# EAGLE design DotLogger (EAGLE 7.2.0)
CNAME: µArduino; CREVISION: 1.0; DATE: 28.04.2015; DESIGNER: Prajwal Bhattaram
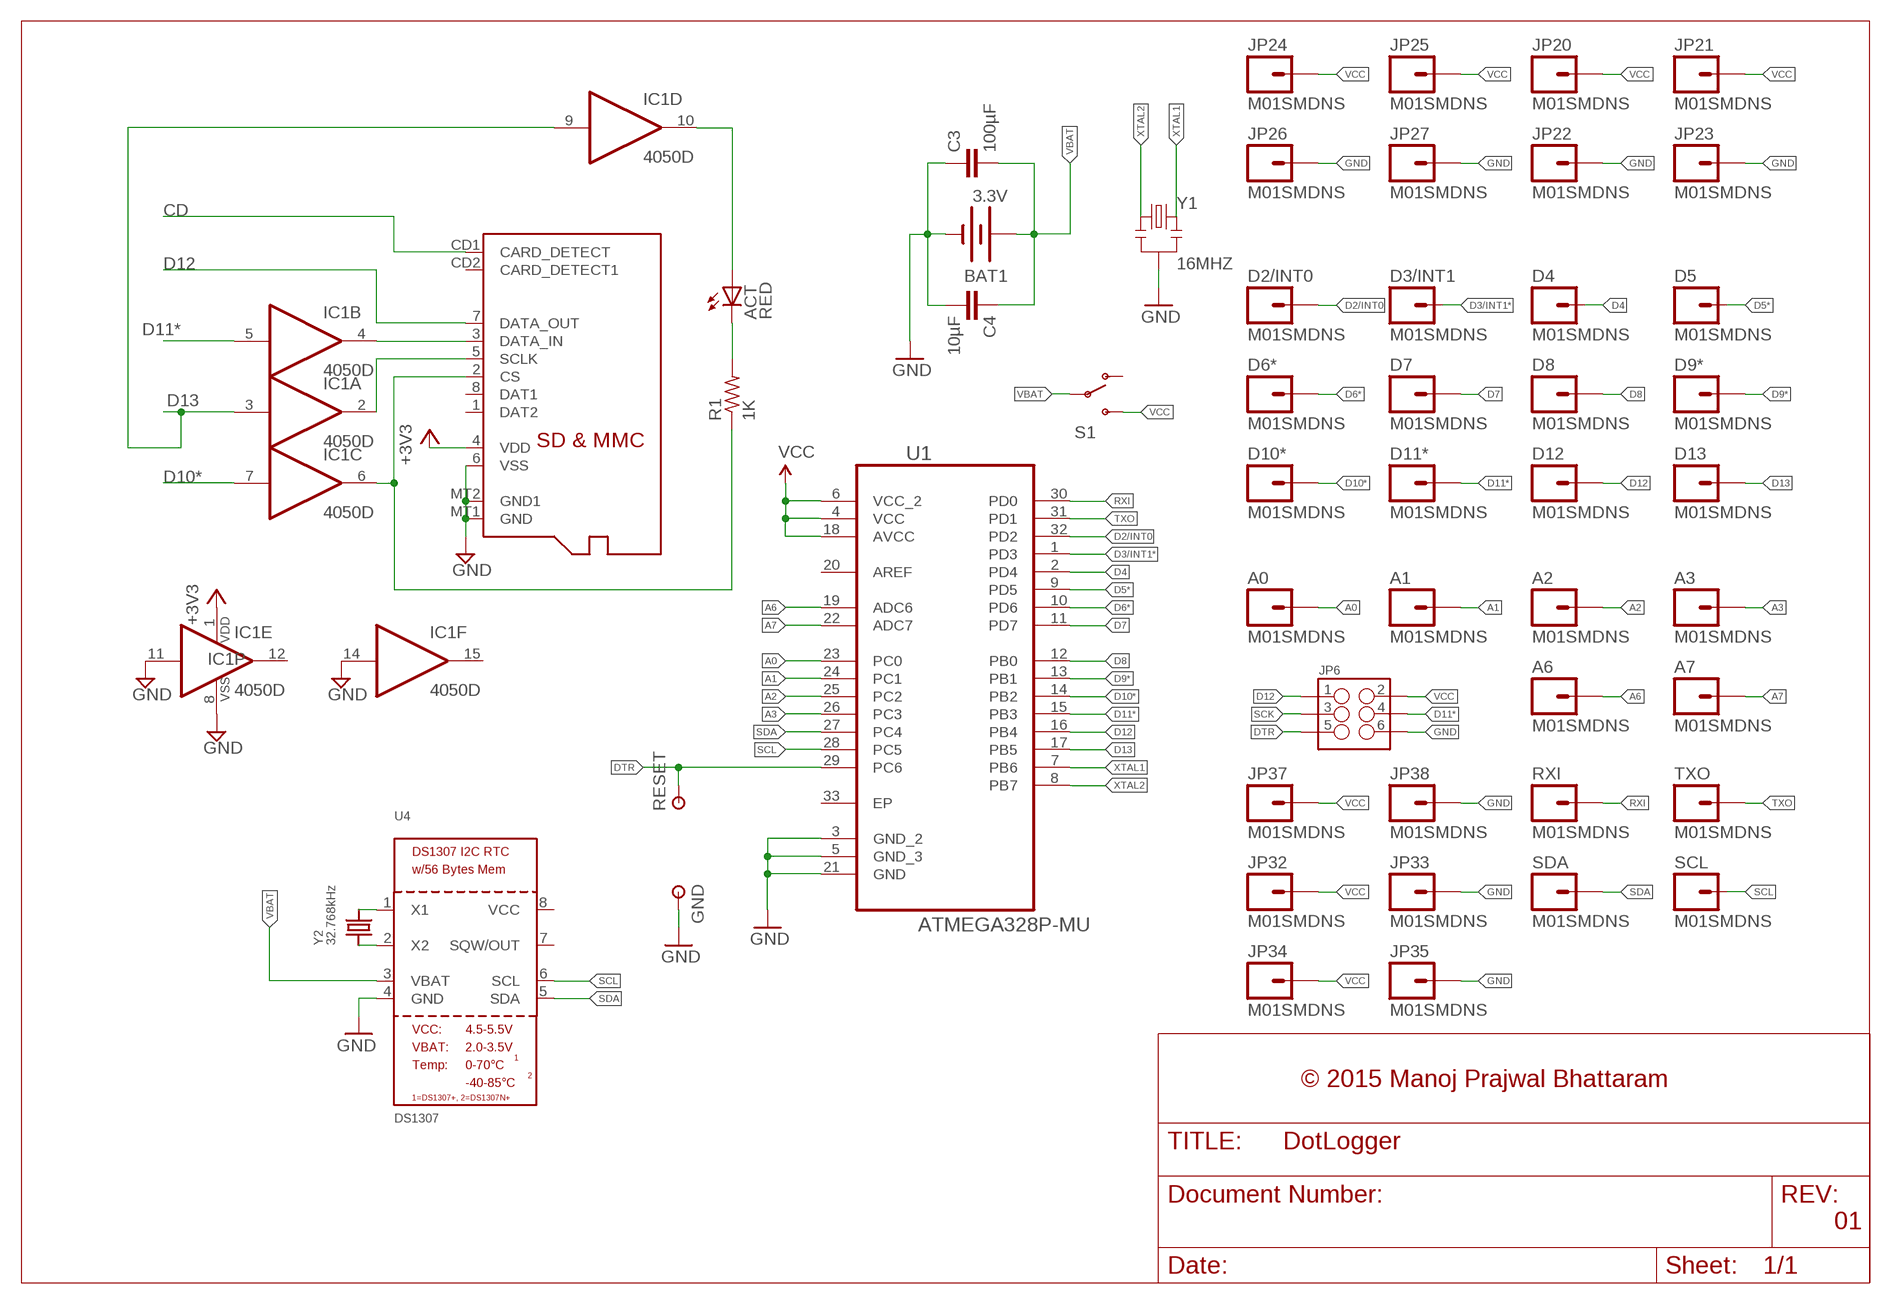
[diagram p0: schematic, sheet 1]

## Parts
A0  M01SMDNS  [1X01NS]
A1  M01SMDNS  [1X01NS]
A2  M01SMDNS  [1X01NS]
A3  M01SMDNS  [1X01NS]
A6  M01SMDNS  [1X01NS]
A7  M01SMDNS  [1X01NS]
ACT  RED  LEDCHIP-LED0805  [CHIP-LED0805]
BAT1  3.3V  BATTERY20SMD  [BATTCON_20MM]
C3  100µF  CAP0402-CAP  [0402-CAP]
C4  10µF  CAP0402-CAP  [0402-CAP]
D2/INT0  M01SMDNS  [1X01NS]
D3/INT1  M01SMDNS  [1X01NS]
D4  M01SMDNS  [1X01NS]
D5  M01SMDNS  [1X01NS]
D6*  M01SMDNS  [1X01NS]
D7  M01SMDNS  [1X01NS]
D8  M01SMDNS  [1X01NS]
D9*  M01SMDNS  [1X01NS]
D10*  M01SMDNS  [1X01NS]
D11*  M01SMDNS  [1X01NS]
D12  M01SMDNS  [1X01NS]
D13  M01SMDNS  [1X01NS]
GND  PAD-TESTPOINT  [1,6/0,8]
IC1  4050D  [SO16]
JP6  M03X2POGO_PINS  [2X3_POGO]
JP20  M01SMDNS  [1X01NS]
JP21  M01SMDNS  [1X01NS]
JP22  M01SMDNS  [1X01NS]
JP23  M01SMDNS  [1X01NS]
JP24  M01SMDNS  [1X01NS]
JP25  M01SMDNS  [1X01NS]
JP26  M01SMDNS  [1X01NS]
JP27  M01SMDNS  [1X01NS]
JP32  M01SMDNS  [1X01NS]
JP33  M01SMDNS  [1X01NS]
JP34  M01SMDNS  [1X01NS]
JP35  M01SMDNS  [1X01NS]
JP37  M01SMDNS  [1X01NS]
JP38  M01SMDNS  [1X01NS]
R1  1K  R-US_R0805  [R0805]
RESET  PAD-TESTPOINT  [1,6/0,8]
RXI  M01SMDNS  [1X01NS]
S1  SWITCH-SPDT-SMD-A  [SWITCH-SPST-SMD-A]
SCL  M01SMDNS  [1X01NS]
SDA  M01SMDNS  [1X01NS]
TXO  M01SMDNS  [1X01NS]
U1  ATMEGA328P-MU  [QFN50P500X500X100-33N]
U4  DS1307  RTC_DS1307  [SOIC8_150MIL]
X1  MICROSD  [MICROSD]
Y1  16MHZ  RESONATOR16MHZ  [RESONATOR-SMD]
Y2  32.768kHz  CRYSTAL8X3.8SMT  [CRYSTAL_8X3.8]

## Nets
+3V3: IC1.1(P:VDD) X1.4(VDD)
A0: A0.1 U1.23(PC0)
A1: A1.1 U1.24(PC1)
A2: A2.1 U1.25(PC2)
A3: A3.1 U1.26(PC3)
A6: A6.1 U1.19(ADC6)
A7: A7.1 U1.22(ADC7)
CD: X1.CD1(CARD_DETECT)
D2/INT0: D2/INT0.1 U1.32(PD2)
D3/INT1*: D3/INT1.1 U1.1(PD3)
D4: D4.1 U1.2(PD4)
D5*: D5.1 U1.9(PD5)
D6*: D6*.1 U1.10(PD6)
D7: D7.1 U1.11(PD7)
D8: D8.1 U1.12(PB0)
D9*: D9*.1 U1.13(PB1)
D10*: D10*.1 IC1.7(C:I) U1.14(PB2)
D11*: D11*.1 IC1.5(B:I) JP6.P$4 U1.15(PB3)
D12: D12.1 JP6.P$1 U1.16(PB4) X1.7(DATA_OUT)
D13: D13.1 IC1.3(A:I) IC1.9(D:I) U1.17(PB5)
DTR: JP6.P$5 RESET.1(P) U1.29(PC6)
GND: BAT1.2(-) C3.1 C4.2 GND.1(P) IC1.8(P:VSS) IC1.11(E:I) IC1.14(F:I) JP6.P$6 JP22.1 JP23.1 JP26.1 JP27.1 JP33.1 JP35.1 JP38.1 U1.3(GND_2) U1.5(GND_3) U1.21(GND) U4.4(GND) X1.6(VSS) X1.MT1(GND) X1.MT2(GND1) Y1.2
N$1: ACT.A IC1.10(D:O)
N$2: IC1.2(A:O) X1.5(SCLK)
N$3: IC1.6(C:O) R1.1 X1.2(CS)
N$4: ACT.C R1.2
N$5: IC1.4(B:O) X1.3(DATA_IN)
N$6: U4.2(X2) Y2.P$1
N$7: U4.1(X1) Y2.P$4
RXI: RXI.1 U1.30(PD0)
SCK: JP6.P$3
SCL: SCL.1 U1.28(PC5) U4.6(SCL)
SDA: SDA.1 U1.27(PC4) U4.5(SDA)
TXO: TXO.1 U1.31(PD1)
VBAT: BAT1.1(+) C3.2 C4.1 S1.2(P) U4.3(VBAT)
VCC: JP6.P$2 JP20.1 JP21.1 JP24.1 JP25.1 JP32.1 JP34.1 JP37.1 S1.3(S) U1.4(VCC) U1.6(VCC_2) U1.18(AVCC)
XTAL1: U1.7(PB6) Y1.3
XTAL2: U1.8(PB7) Y1.1
Unconnected: IC1.12(E:O) IC1.15(F:O) S1.1(O) U1.20(AREF) U1.33(EP) U4.7(SQW/OUT) U4.8(VCC) X1.1(DAT2) X1.8(DAT1) X1.CD2(CARD_DETECT1)

## Notes on the sheet
- © 2015 Manoj Prajwal Bhattaram
- 01

## Library data of the parts
A0 A1-A3 A6 A7 D2/INT0 D3/INT1 D4 D5 D6* D7 D8 D9* D10* D11* D12 D13 JP20-JP27 JP32-JP35 JP37 JP38 RXI SCL SDA TXO = SparkFun-Connectors:M01: Header 1 Standard 1-pin 0.1" header. Use with straight break away headers (SKU : PRT-00116), right angle break away headers (PRT-00553), swiss pins (PRT-00743), machine pins (PRT-00117), and female headers (PRT-00115).
ACT = adafruit:LED: LED OSRAM: - CHIPLED LG R971, LG N971, LY N971, LG Q971, LY Q971, LO R971, LY R971 LH N974, LH R974 LS Q976, LO Q976, LY Q976 LO Q996 - Hyper CHIPLED LW Q18S LB Q993, LB Q99A, LB R99A - SideLED LS A670, LO A670, LY A670, LG A670, LP A670 LB A673, LV A673, LT A673, LW A673 LH A674 LY A675 LS A676, LA A676, LO A676, LY A676, LW A676 LS A679, LY A679, LG A679 - Hyper Micro SIDELED® LS Y876, LA Y876, LO Y876, LY Y876 LT Y87S - SmartLED LW L88C, LW L88S LB L89C, LB L89S, LG L890 LS L89K, LO L89K, LY L89K LS L896, LA L896, LO L896, LY L896 - TOPLED LS T670, LO T670, LY T670, LG T670, LP T670 LSG T670, LSP T670, LSY T670, LOP T670, LYG T670 LG T671, LOG T671, LSG T671 LB T673, LV T673, LT T673, LW T673 LH T674 LS T676, LA T676, LO T676, LY T676, LB T676, LH T676, LSB T676, LW T676 LB T67C, LV T67C, LT T67C, LS T67K, LO T67K, LY T67K, LW E67C LS E67B, LA E67B, LO E67B, LY E67B, LB E67C, LV E67C, LT E67C LW T67C LS T679, LY T679, LG T679 LS T770, LO T770, LY T770, LG T770, LP T770 LB T773, LV T773, LT T773, LW T773 LH T774 LS E675, LA E675, LY E675, LS T675 LS T776, LA T776, LO T776, LY T776, LB T776 LHGB T686 LT T68C, LB T68C - Hyper Mini TOPLED® LB M676 - Mini TOPLED Santana® LG M470 LS M47K, LO M47K, LY M47K Source: http://www.osram.convergy.de/
BAT1 = SparkFun-Electromechanical:BATTERY: Battery Holders Various common sizes : AA, AAA, 20mm coin cell and 12mm coin cell. 20MM_4LEGS, BATT-10373
C3 C4 = SparkFun-Capacitors:CAP: Capacitor Standard 0603 ceramic capacitor, and 0.1" leaded capacitor.
GND RESET = ee2parts:PAD-TESTPOINT: SMALL THROUGH-HOLE PAD/TESTPOINT Pad suitable for use as a test point (no pin)
IC1 = 40xx:4050: Hex non-inverting BUFFER
JP6 = SparkFun-Connectors:M03X2: 2x3 .1" header. Shrouded, with keying- CONN-10681 SMT- CONN-11415 Pogo pins- HW-11044; PROD_ID: HW-11044
R1 = adafruit:R-US_: RESISTOR, American symbol
S1 = SparkFun-Electromechanical:SWITCH-SPDT: SPDT Switch Simple slide switch, Spark Fun Electronics SKU : COM-00102 DPDT SMT slide switch, AYZ0202, SWCH-08179
U1 = Atmel:ATMEGA328P-MU: Programmable Flash; MPN: ATMEGA328P-MU; OC_FARNELL: 1748522; OC_NEWARK: 26R2526; PACKAGE: QFN-32; SUPPLIER: Atmel
U4 = microbuilder:RTC_DS1307: DS1307 I2C RTC with 56-Bytes RAM
X1 = adafruit:MICROSD: Micro-SD / Transflash card holder with SPI pinout For the 3M # 2908-05WB-MG and/or 4UCON #19656 push-push type
Y1 = SparkFun-FreqCtrl:RESONATOR: Resonator Small SMD resonator. Used, eg, on the Arduino Pro/ Pro Mini boards. 8MHz- XTAL-08895 16MHz- XTAL-08900; PROD_ID: XTAL-08900
Y2 = microbuilder:CRYSTAL: Crystals HC49UP - Surface Mount Crystal 4.0MHz 18pF +/-30ppm Surface Mount Crystal [Digikey: 535-9857-1-ND] 12.0 MHz Surface Mount Crystal [Digikey: 535-9869-6-ND] 25.0 MHz Surface Mount Crystal [Digikey: 535-9078-1-ND] 3.2 x 2.5mm - MEMs SMT Crystal 12.0 MHz 8pF 15ppm 3.2 x 2.5mm Crystal [Digikey: -10-70°C: 644-1047-1-ND -40-125°C: 644-1128-1-ND] 16.0 MHz 8pF 15ppm 3.2 x 2.5mm Crystal [Digikey: -10-70°C: 644-1049-1-ND -40-125°C: 644-1129-2-ND] 16.0 MHz 10pF 10ppm 3.2 x 2.5mm Crystal [Digikey: 644-1100-1-ND] 27.12 MHz 18pF 30ppm 3.2 x 2.5mm Crystal [Digikey: 887-1424-1-ND] 27.12MHz 10pF 10ppm 3.2 x 2.5mm Crystal [Digikey: 887-1329-1-ND] 4.9 x 1.8mm - MEMs SMT Crystal 32.768 KHz 12.5pF 20ppm 4.9 x 1.8mm Crystal [Digikey: SE2415CT-ND] 8.0 x 3.8mm - Surface Mount Crystal 32.768kHz 12.5pF 20ppm -40°C-85°C [Digikey: 535-9166-2-ND] Cylinder 32.768KHz Cylinder Crystal (2x6mm body) [Ex. Digikey: 300-8341-2-ND]

## Board
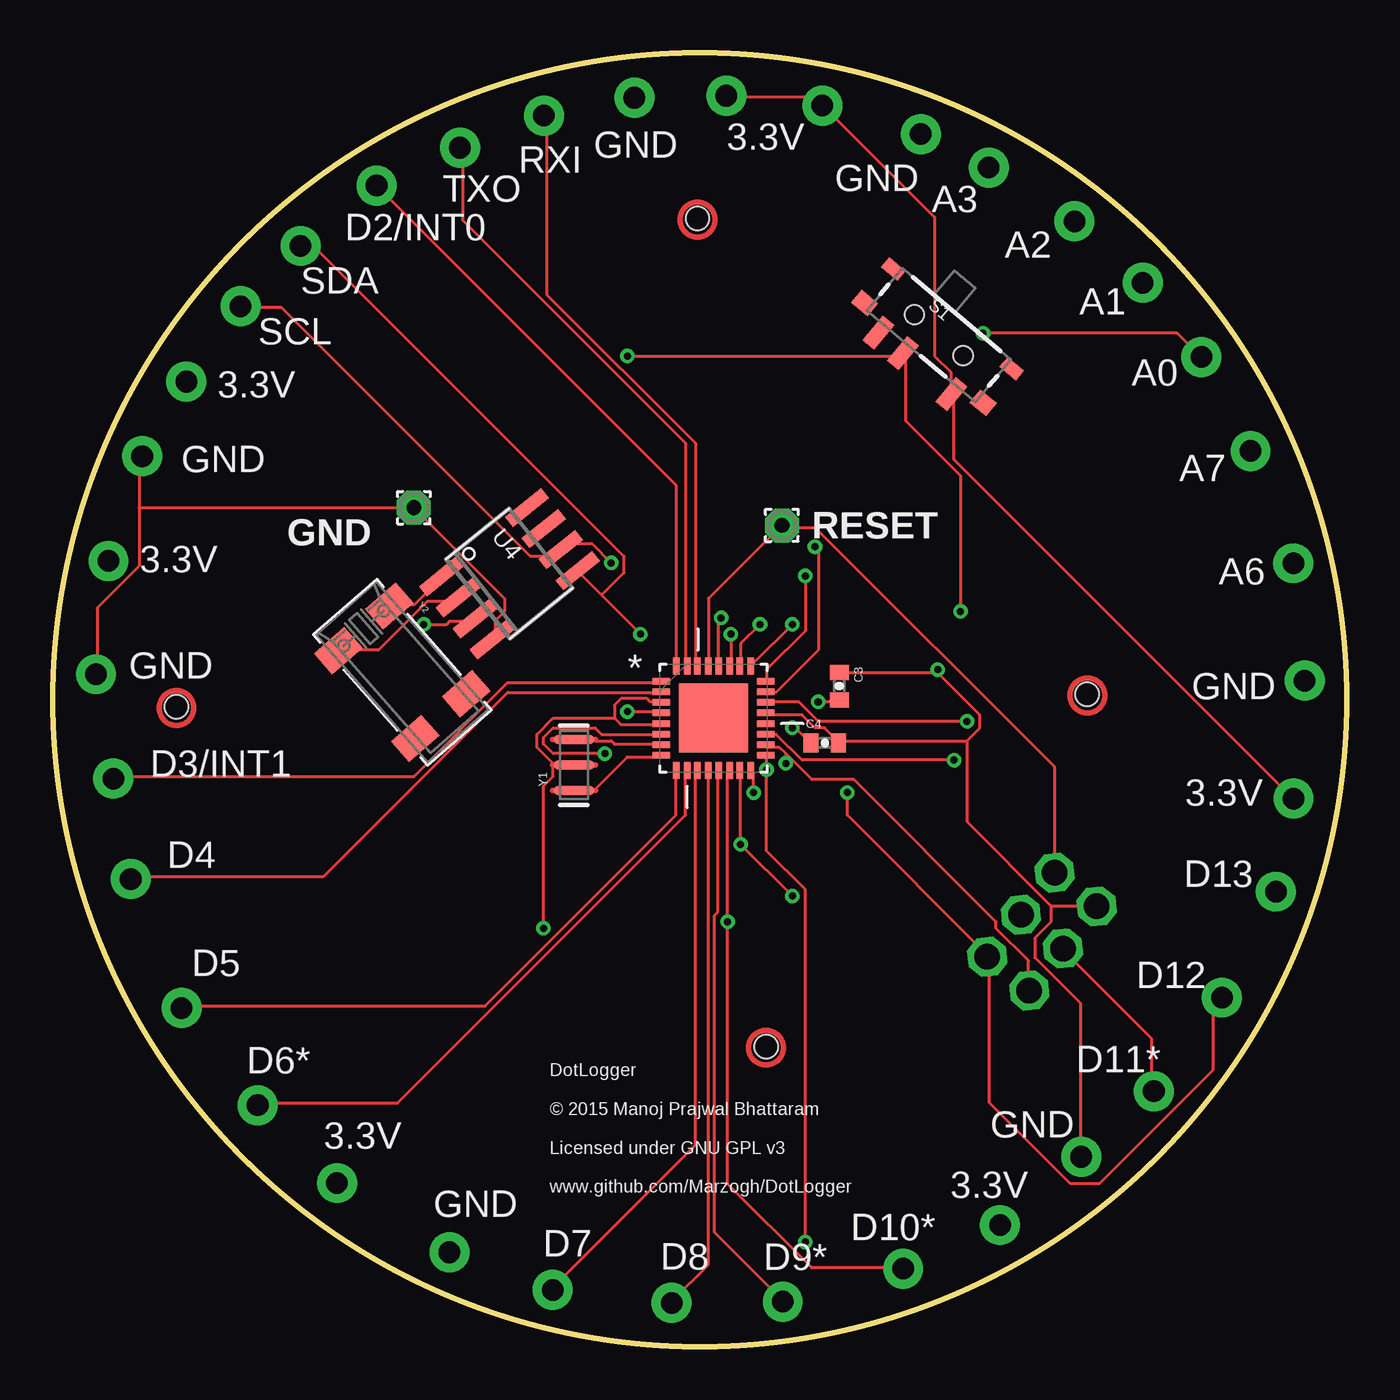
[diagram p1: board, top side]
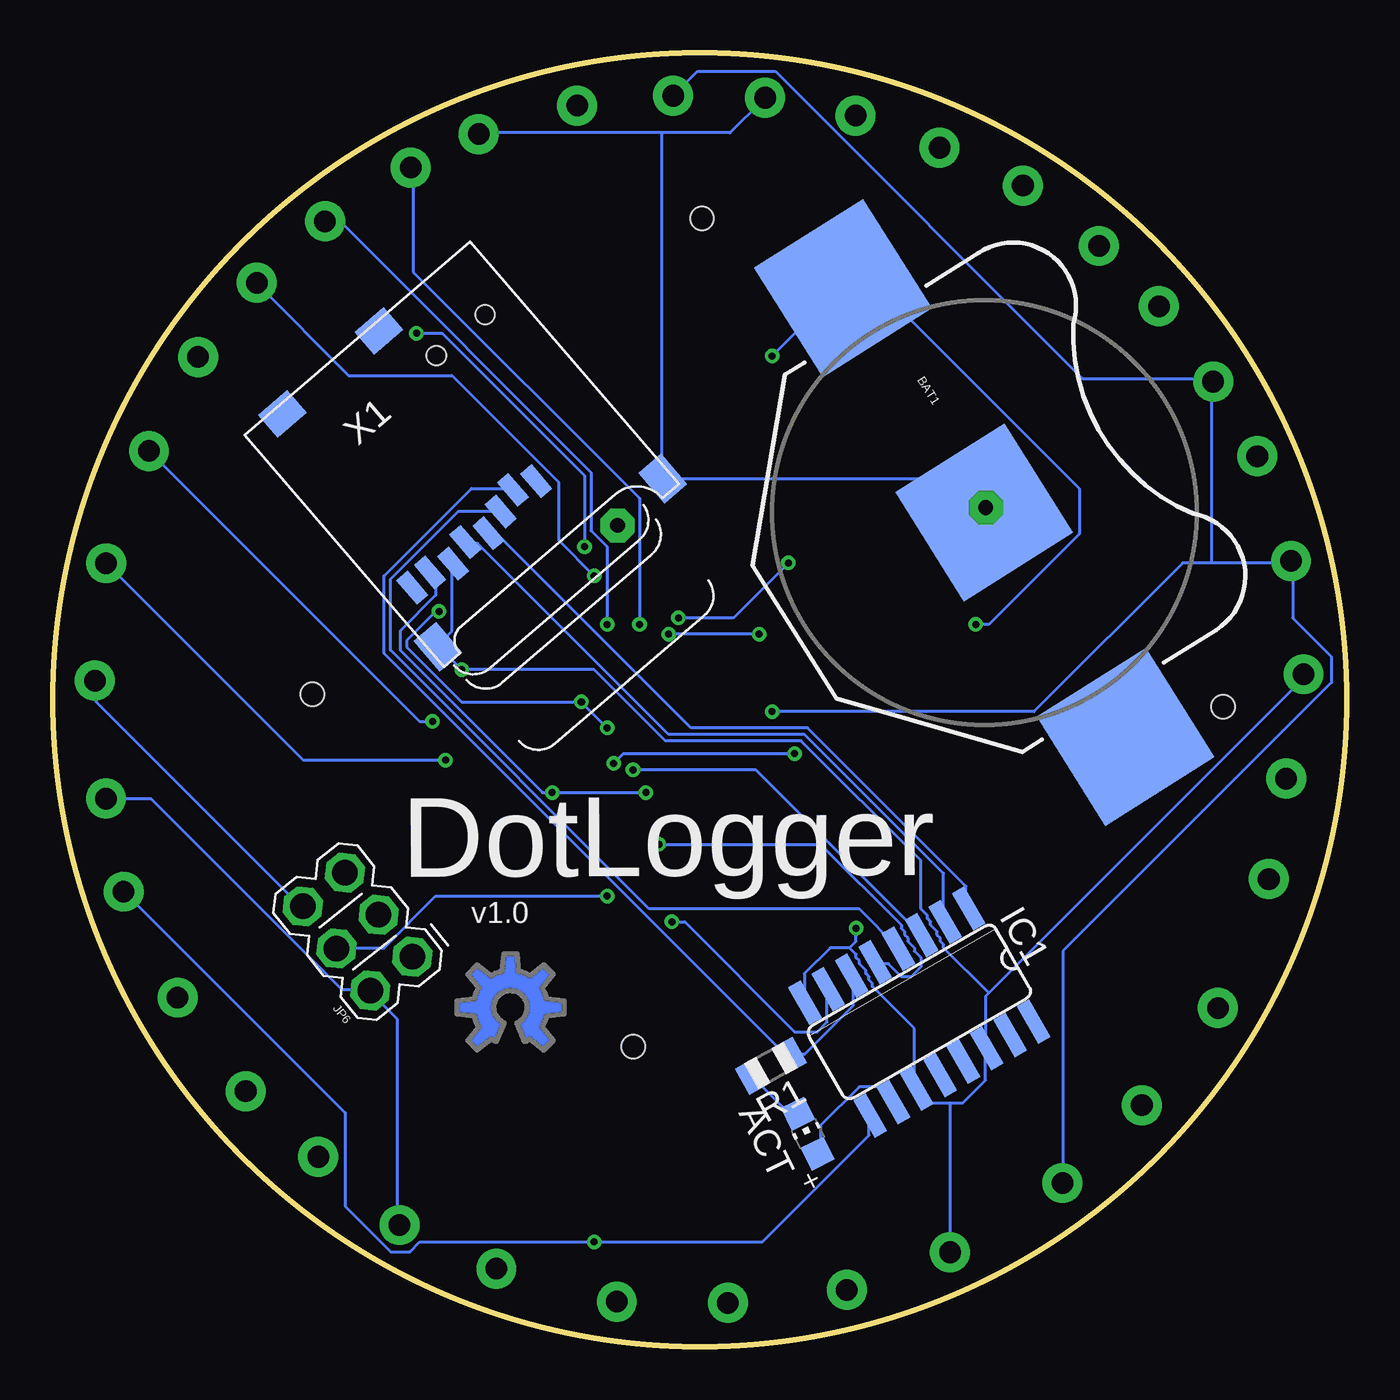
[diagram p2: board, bottom side, seen from below]

Size 60.96 x 60.96 mm. Coordinates in mm from the lower left corner, seen from the top.
Outline: circle at 30.48,30.48 radius 30.48
Copper layers (1*16): Top 0.0356mm / dielectric 1.5011mm / Bottom 0.0356mm
Design rules "OSH Park Design guidelines": minimum track width 6mil, minimum drill 13mil, track to track 6mil, track to pad 6mil, pad to pad 6mil, via to via 6mil, smd to smd 6mil, copper to edge 15mil, drill to drill 6mil, minimum pad ring 7mil, minimum via ring 7mil, stop-mask expansion 3mil, vias tented up to drill 0mil, thermal gap 10mil
Holes 1.1 mm at 30.37,53.16 33.61,14.14 48.74,30.74 5.81,30.15

### Footprints (pad centres in the part's own frame; a part is rotated, then mirrored left to right if it is on the bottom)
1X01NS = drill 1.016 pad 1.88: 1 0,0
CHIP-LED0805 = smd 1.2 x 1.2: A 0,-1.05; C 0,1.05
BATTCON_20MM = smd 6.07 x 6.07: 1 -12.5,0; 2 0,0; 3 12.5,0
0402-CAP = smd 0.7 x 0.9: 1 -0.65,0; 2 0.65,0
1,6/0,8 = drill 0.7 pad 1.6 octagon: 1 0,0
SO16 = smd 0.66 x 2.032: 1 -4.445,-3.073; 2 -3.175,-3.073; 3 -1.905,-3.073; 4 -0.635,-3.073; 5 0.635,-3.073; 6 1.905,-3.073; 7 3.175,-3.073; 8 4.445,-3.073; 9 4.445,3.073; 10 3.175,3.073; 11 1.905,3.073; 12 0.635,3.073; 13 -0.635,3.073; 14 -1.905,3.073; 15 -3.175,3.073; 16 -4.445,3.073
2X3_POGO = drill 1.2 pad 1.829 octagon: P$1 0,0; P$2 0,2.54; P$3 2.54,0; P$4 2.54,2.54; P$5 5.08,0; P$6 5.08,2.54
R0805 = smd 1.1 x 1.4: 1 -1,0; 2 1,0
SWITCH-SPST-SMD-A = smd 0.7 x 1.5: 1 -2.25,-1.75; 2 -0.75,-1.75; 3 2.25,-1.75 | smd 1 x 0.6: GND1 -3.65,1; GND3 3.65,1 | smd 1 x 0.8: GND2 -3.65,-1.1; GND4 3.65,-1.1 | hole 0.9: -1.5,0; 1.5,0
QFN50P500X500X100-33N = smd 0.813 x 0.305: 1 -2.464,1.753; 2 -2.464,1.245; 3 -2.464,0.762; 4 -2.464,0.254; 5 -2.464,-0.254; 6 -2.464,-0.762; 7 -2.464,-1.245; 8 -2.464,-1.753; 17 2.464,-1.753; 18 2.464,-1.245; 19 2.464,-0.762; 20 2.464,-0.254; 21 2.464,0.254; 22 2.464,0.762; 23 2.464,1.245; 24 2.464,1.753 | smd 0.305 x 0.813: 9 -1.753,-2.464; 10 -1.245,-2.464; 11 -0.762,-2.464; 12 -0.254,-2.464; 13 0.254,-2.464; 14 0.762,-2.464; 15 1.245,-2.464; 16 1.753,-2.464; 25 1.753,2.464; 26 1.245,2.464; 27 0.762,2.464; 28 0.254,2.464; 29 -0.254,2.464; 30 -0.762,2.464; 31 -1.245,2.464; 32 -1.753,2.464 | smd 3.251 x 3.251: 33 0,0
SOIC8_150MIL = smd 0.6 x 2.2: 1 -1.905,-2.6; 2 -0.635,-2.6; 3 0.635,-2.6; 4 1.905,-2.6; 5 1.905,2.6; 6 0.635,2.6; 7 -0.635,2.6; 8 -1.905,2.6
MICROSD = smd 0.7 x 1.5: 1 9,-10.64; 2 7.9,-10.24; 3 6.8,-10.64; 4 5.7,-11.04; 5 4.6,-10.64; 6 3.5,-11.04; 7 2.4,-10.64; 8 1.3,-10.64 | smd 1.8 x 1.4: CD1 2,-0.44; CD2 8,-0.44 | smd 1.4 x 1.9: MT1 0.4,-13.54; MT2 13.6,-14.44
RESONATOR-SMD = smd 0.45 x 1.905: 1 -1.2,0; 2 0,0; 3 1.2,0
CRYSTAL_8X3.8 = smd 1.3 x 1.9: P$1 -2.75,-1.6; P$2 2.75,-1.6; P$3 2.75,1.6; P$4 -2.75,1.6

### Placement (x,y rotation side)
A0  54.12,46.63 0 top
A1  51.36,50.13 0 top
A2  48.14,53.03 0 top
A3  44.1,55.56 0 top
A6  58.46,36.91 0 top
A7  56.44,42.2 0 top
ACT  25.39,10.03 26.1 bottom
BAT1  17.07,39.31 302.2 bottom
C3  37.06,31.12 270 top
C4  36.37,28.45 0 top
D2/INT0  15.25,54.72 180 top
D3/INT1  2.84,26.76 90 top
D4  3.66,22.03 0 top
D5  6.05,15.95 0 top
D6*  9.64,11.37 0 top
D7  23.55,2.67 0 top
D8  29.15,2.05 0 top
D9*  34.39,2.11 0 top
D10*  40.07,3.66 0 top
D11*  51.88,12.03 0 top
D12  55.09,16.44 0 top
D13  57.64,21.43 0 top
GND  17,39.53 180 top
IC1  20.13,15.76 209.9 bottom
JP6  44.03,18.36 128.7 bottom
JP20  2.61,37.02 0 top
JP21  36.25,58.48 0 top
JP22  18.69,4.44 0 top
JP23  2.02,31.68 0 top
JP24  58.47,25.83 0 top
JP25  13.38,7.7 0 top
JP26  40.9,57.14 0 top
JP27  58.99,31.38 0 top
JP32  6.28,45.47 0 top
JP33  4.2,41.96 0 top
JP34  44.63,5.72 0 top
JP35  48.46,8.94 0 top
JP37  31.74,58.95 0 top
JP38  27.4,58.86 0 top
R1  27.13,13.23 209 bottom
RESET  34.35,38.7 180 top
RXI  23.14,58.01 0 top
S1  41.75,47.67 319.9 top
SCL  8.84,49.03 0 top
SDA  11.67,51.87 0 top
TXO  19.18,56.5 0 top
U1  31.13,29.61 0 top
U4  21.51,36.42 308.8 top
U$1  [OSHWLOGO_TOP_0.2]  39.4,15.98 0 bottom
X1  51.95,42.98 40.7 bottom
Y1  24.56,27.4 90 top
Y2  16.46,31.78 311.2 top

### Tracks (layer width: path | path; a pad name or v marks a point on that pad's centre or on a via)
+3V3
  Bottom 0.152: X1.4 40.33,38.3 40.03,38.3 30.88,29.16 25.4,29.16 17.93,21.69 17.93,20.77 IC1.1
A0  (via drill 0.33)
  Top 0.152: v35.91,37.69 36.06,37.54 36.06,32.81 34.08,30.83 33.62,30.83 U1.23 | v43.84,47.75 52.98,47.75 54.05,46.68 A0.1
  Bottom 0.152: v35.91,37.69 35.91,41.04 42.62,47.75 v43.84,47.75
A1  (via drill 0.33)
  Top 0.152: v35.45,36.32 35.45,33.73 33.62,31.9 33.62,31.44 U1.24
  Bottom 0.152: v35.45,36.32 37.13,38 37.13,40.74 42.16,45.77 47.04,45.77 51.3,50.04 A1.1
A2  (via drill 0.33)
  Top 0.152: v34.84,34.03 33.02,32.2 U1.25
  Bottom 0.152: v34.84,34.03 34.84,37.69 35.61,38.45 35.61,41.2 47.34,52.93 48.1,52.93 A2.1
A3  (via drill 0.33)
  Top 0.152: v33.32,34.03 32.41,33.12 32.41,32.2 U1.26
  Bottom 0.152: v33.32,34.03 33.32,39.98 43.99,50.65 43.99,55.52 A3.1
A6  (via drill 0.33)
  Top 0.152: v42.46,27.63 35.3,27.63 34.08,28.85 33.62,28.85 U1.19
  Bottom 0.152: v42.46,27.63 49.17,27.63 58.31,36.78 A6.1
A7  (via drill 0.33)
  Top 0.152: v43.07,29.46 36.06,29.46 35.15,30.38 33.62,30.38 U1.22
  Bottom 0.152: v43.07,29.46 43.68,29.46 56.33,42.11 A7.1
D2/INT0
  Top 0.152: U1.32 29.36,32.2 29.36,40.59 15.34,54.61 D2/INT0.1
D3/INT1*
  Top 0.152: U1.1 28.6,31.29 21.43,31.29 17.01,26.87 2.84,26.87 D3/INT1.1
D4
  Top 0.152: U1.2 28.6,30.83 21.43,30.83 12.75,22.15 3.75,22.15 D4.1
D5*
  Top 0.152: U1.9 29.36,27.02 29.36,25.04 20.37,16.05 6.19,16.05 D5.1
D6*
  Top 0.152: U1.10 29.81,27.02 29.81,25.04 16.25,11.48 9.7,11.48 D6*.1
D7
  Top 0.152: U1.11 30.27,27.02 30.27,9.5 23.57,2.79 D7.1
D8
  Top 0.152: U1.12 30.88,27.02 30.88,3.86 29.21,2.18 D8.1
D9*
  Top 0.152: U1.13 31.34,27.02 31.34,20.47 31.19,20.32 31.19,5.38 34.39,2.18 D9*.1
D10*  (via drill 0.33)
  Top 0.152: U1.14 31.8,27.02 v31.8,20.01 31.8,7.67 35.76,3.71 40.03,3.71 D10*.1
  Bottom 0.152: v31.8,20.01 31.19,20.01 26,14.83 24.94,14.83 24.48,15.29 24.48,16.81 IC1.7
D11*  (via drill 0.33)
  Top 0.152: v34.84,21.23 v32.41,23.67 32.41,27.02 U1.15 | D11*.1 51.76,12.09 51.76,14.53 47.65,18.64 JP6.P$4
  Bottom 0.152: v34.84,21.23 42.92,21.23 45.36,18.79 47.49,18.79 JP6.P$4 | v32.41,23.67 24.79,23.67 20.98,19.86 20.98,19.71 20.82,19.56 20.82,19.4 20.67,19.25 20.67,19.1 20.37,18.79 20.37,18.64 20.06,18.34 20.06,17.88 20.52,17.42 20.98,17.42 21.59,18.03 22.19,18.03 IC1.5
D12  (via drill 0.33)
  Top 0.152: v33.02,26.11 33.02,27.02 U1.16 | D12.1 54.96,16.36 54.66,16.05 54.66,13 49.32,7.67 47.95,7.67 44.14,11.48 44.14,18.34 JP6.P$1 43.99,18.49 37.43,25.04 v37.43,26.11
  Bottom 0.152: v33.02,26.11 v37.43,26.11 37.89,26.11 44.6,32.81 44.6,33.73 42.92,35.41 42.92,36.32 43.07,36.47 X1.7
D13  (via drill 0.33)
  Top 0.152: U1.17 33.62,27.79 v33.62,27.18 33.62,23.37 35.45,21.54 v35.45,4.93
  Bottom 0.152: v33.62,27.18 27.83,27.18 20.06,19.4 IC1.3 | IC1.9 22.5,10.87 22.5,9.95 27.53,4.93 v35.45,4.93 43.68,4.93 44.14,4.47 45.05,4.47 47.19,6.6 47.19,11.02 57.55,21.38 D13.1
DTR
  Top 0.152: U1.29 30.88,32.2 30.88,35.25 34.23,38.61 RESET.1 34.39,38.61 35.91,38.61 47.19,27.33 47.19,22.45 JP6.P$5
GND  (via drill 0.33)
  Top 0.152: U1.21 33.62,29.77 35.3,29.77 35.91,29.16 36.37,29.16 36.98,28.55 C4.2 37.13,28.55 43.07,28.55 | 41.7,31.75 37.13,31.75 C3.1 | 41.7,31.75 43.68,29.77 43.68,29.16 43.07,28.55 | 41.7,31.75 v41.7,31.9 | 47.04,20.77 49.17,20.77 JP6.P$6 | 47.04,20.77 43.07,24.74 43.07,28.55 | 47.04,20.77 47.04,20.01 46.27,19.25 46.27,18.34 48.41,16.2 48.41,9.04 JP35.1 | 26.46,29.61 26.77,29.31 28.6,29.31 U1.5 | 26.46,29.61 26.46,30.22 26.77,30.53 27.99,30.53 28.14,30.38 28.6,30.38 U1.3 | 26.46,29.61 23.57,29.61 22.8,28.85 22.8,28.24 23.57,27.48 23.54,27.4 23.57,27.33 23.57,26.87 23.11,26.41 v23.11,19.71 | 4.06,39.52 4.06,41.81 JP33.1 | 4.06,39.52 4.06,36.78 2.08,34.8 2.08,31.75 JP23.1 | U4.4 20.82,33.42 20.82,34.19 21.28,34.64 21.28,35.25 17.01,39.52 GND.1 16.86,39.52 4.06,39.52
  Bottom 0.152: X1.6 42.16,36.78 42.16,33.73 42.77,33.12 X1.MT1 42.77,32.97 v41.7,31.9 35.45,31.9 32.1,28.55 25.7,28.55 20.06,22.91 20.06,20.62 19.76,20.32 19.76,20.17 19.6,20.01 19.6,19.86 19.3,19.56 19.3,19.4 19.15,19.25 19.15,19.1 18.99,18.95 18.99,18.79 16.86,16.66 | JP27.1 58.92,31.29 58.92,30.38 49.32,20.77 JP6.P$6 | 18.69,11.48 19.6,11.48 20.21,12.09 IC1.11 20.37,12.24 20.37,14.98 22.35,16.96 22.35,17.12 22.5,17.27 22.5,17.42 22.65,17.57 22.65,17.73 22.96,18.03 22.96,18.18 23.11,18.34 23.11,18.49 23.41,18.79 | 18.69,11.48 18.08,11.48 17.01,12.55 17.01,13.92 IC1.14 17.01,14.07 17.01,16.51 16.86,16.66 | 23.41,18.79 24.33,18.79 25.55,17.57 25.55,16.36 IC1.8 | v23.11,19.71 23.11,19.1 23.41,18.79 | 18.69,11.48 18.69,4.47 JP22.1 | 32.25,57.2 29.05,57.2 27.53,58.72 JP38.1 | 32.25,57.2 40.79,57.2 JP26.1 | GND.1 17.01,39.52 BAT1.2 17.01,39.67 18.23,40.89 32.1,40.89 X1.MT2 32.25,41.04 32.25,57.2 | 16.86,16.66 1.93,31.6 JP23.1
N$1
  Bottom 0.152: ACT.A 24.79,9.19 24.79,10.41 22.96,12.24 22.04,12.24 21.43,11.63 IC1.10
N$2
  Bottom 0.152: X1.5 41.4,37.84 40.94,37.84 31.95,28.85 25.55,28.85 18.99,22.3 18.99,20.01 IC1.2
N$3
  Bottom 0.152: IC1.6 23.26,17.42 23.26,16.05 25.55,13.76 26.16,13.76 R1.1 26.31,13.61 45.36,32.66 45.36,36.32 41.24,40.43 39.42,40.43 X1.2
N$4
  Bottom 0.152: ACT.C 25.85,11.02 26.31,11.02 27.99,12.7 R1.2
N$5
  Bottom 0.152: X1.3 39.87,39.37 41.85,39.37 45.05,36.17 45.05,32.81 32.86,20.62 22.96,20.62 21.13,18.79 IC1.4
N$6
  Top 0.152: Y2.P$1 13.51,32.81 15.34,32.81 17.62,35.1 18.84,35.1 18.99,35.25 U4.2
N$7
  Top 0.152: Y2.P$4 15.95,34.95 17.01,34.95 18.23,36.17 U4.1
RXI
  Top 0.152: U1.30 30.27,32.2 30.27,42.57 23.26,49.58 23.26,57.96 RXI.1
SCL  (via drill 0.33)
  Top 0.152: v31.49,34.34 31.34,34.19 31.34,32.2 U1.28 | v26.31,36.93 25.4,37.84 24.18,37.84 24.02,37.69 U4.6 23.87,37.54 23.57,37.23 22.5,37.23 10.76,48.97 8.94,48.97 SCL.1
  Bottom 0.152: v31.49,34.34 28.9,34.34 v26.31,36.93
SDA  (via drill 0.33)
  Top 0.152: v31.95,33.58 31.95,32.2 U1.27 | 25.85,35.41 24.79,36.47 U4.5 | 25.85,35.41 v27.68,33.58 | 25.85,35.41 26.92,36.47 26.92,37.23 12.29,51.86 11.68,51.86 SDA.1
  Bottom 0.152: v27.68,33.58 v31.95,33.58
TXO
  Top 0.152: U1.31 29.81,32.2 29.81,42.57 19.3,53.08 19.3,56.44 TXO.1
VBAT  (via drill 0.33)
  Top 0.152: v34.84,29.16 35,29.16 35.61,28.55 C4.1 | v36.06,30.38 36.98,30.38 C3.2 | v27.07,46.68 40.03,46.68 S1.2 40.18,46.68 40.18,43.63 42.77,41.04 v42.77,34.64 | v17.47,34.03 18.54,34.03 18.69,34.19 19.76,34.19 U4.3
  Bottom 0.152: v34.84,29.16 v36.06,30.38 41.7,30.38 44.29,32.97 44.29,33.27 42.92,34.64 v42.77,34.64 | v27.07,46.68 23.87,49.88 BAT1.1 23.72,49.88 22.04,49.88 12.59,40.43 12.59,38.3 16.86,34.03 v17.47,34.03
VCC  (via drill 0.33)
  Top 0.152: v27.07,29.92 28.6,29.92 U1.4 | JP37.1 31.8,58.87 35.91,58.87 36.22,58.57 JP21.1 36.37,58.42 41.55,53.24 41.55,46.68 42.31,45.92 42.31,45.01 S1.3 42.46,44.85 42.46,41.81 58.31,25.96 JP24.1 | 34.54,27.94 35.76,26.72 37.74,26.72 44.45,20.01 44.45,19.71 45.97,18.18 45.97,16.81 JP6.P$2 | 34.54,27.94 34.23,28.24 33.62,28.24 U1.18 | v26,27.94 23.57,27.94 23.11,28.39 23.11,28.7 23.57,29.16 25.55,29.16 25.85,28.85 28.6,28.85 U1.6 | 34.54,27.94 v34.54,27.48
  Bottom 0.152: v27.07,29.92 14.73,29.92 7.72,36.93 6.35,36.93 | 6.35,36.93 2.69,36.93 JP20.1 2.54,36.93 2.54,34.34 0.71,32.51 0.71,31.29 13.36,18.64 13.36,7.82 JP25.1 | 6.35,36.93 6.35,45.46 JP32.1 6.35,45.62 12.44,45.62 26.92,60.09 30.58,60.09 31.64,59.03 JP37.1 | v26,27.94 34.08,27.94 v34.54,27.48 | JP34.1 44.75,5.84 44.75,15.44 45.97,16.66 JP6.P$2 46.12,16.81 47.34,16.81 56.33,25.8 58.31,25.8 JP24.1
XTAL1
  Top 0.152: U1.7 28.6,28.39 26.46,28.39 26.31,28.55 25.55,28.55 Y1.3
XTAL2
  Top 0.152: U1.8 28.6,27.79 27.07,27.79 25.55,26.26 Y1.1
(copper drawn outside any net)
  shapes: Top circle x4

### Text on the board
tNames: 3.3V | GND | GND | 3.3V | GND | 3.3V | GND | GND | 3.3V | 3.3V | GND | 3.3V | GND
_tsilk: DotLogger / / © 2015 Manoj Prajwal Bhattaram / / Licensed under GNU GPL v3 / / www.github.com/Marzogh/DotLogger
_bsilk: DotLogger | v1.0